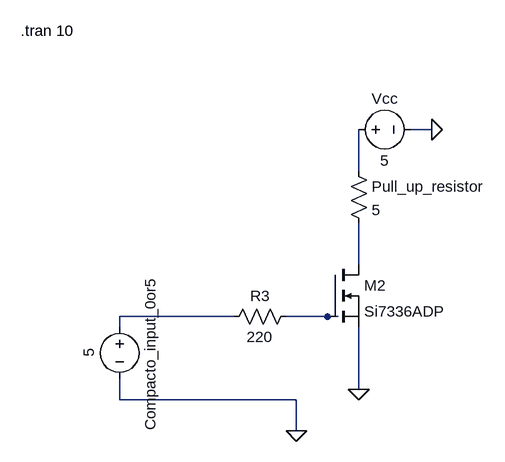
[diagram p0: schematic MOSFET circuit Ayham.asc]
MOSFET circuit Ayham.asc, the LTspice schematic file:
Version 4
SHEET 1 1264 680
WIRE -1472 -16 -1504 -16
WIRE -1584 48 -1584 -16
WIRE -1584 192 -1584 128
WIRE -1776 272 -1952 272
WIRE -1632 272 -1696 272
WIRE -1616 272 -1632 272
WIRE -1952 288 -1952 272
WIRE -1584 384 -1584 288
WIRE -1952 400 -1952 368
WIRE -1680 400 -1952 400
WIRE -1680 448 -1680 400
FLAG -1680 448 0
FLAG -1472 -16 0
FLAG -1584 384 0
SYMBOL voltage -1952 272 R0
WINDOW 0 32 56 VTop 2
WINDOW 3 -32 56 VBottom 2
WINDOW 123 0 0 Left 0
WINDOW 39 0 0 Left 0
SYMATTR InstName Compacto_input_0or5
SYMATTR Value 5
SYMBOL nmos -1632 192 R0
SYMATTR InstName M2
SYMATTR Value Si7336ADP
SYMBOL res -1680 256 R90
WINDOW 0 0 56 VBottom 2
WINDOW 3 32 56 VTop 2
SYMATTR InstName R3
SYMATTR Value 220
SYMBOL voltage -1600 -16 R270
WINDOW 0 32 56 VTop 2
WINDOW 3 -32 56 VBottom 2
WINDOW 123 0 0 Left 0
WINDOW 39 0 0 Left 0
SYMATTR InstName Vcc
SYMATTR Value 5
SYMBOL res -1600 32 R0
SYMATTR InstName Pull_up_resistor
SYMATTR Value 5
TEXT -2104 -168 Left 2 !.tran 10

The netlist it stands for:
* MOSFET circuit Ayham.asc
V§Compacto_input_0or5 N003 0 5
M2 N002 N004 0 0 Si7336ADP
R3 N004 N003 220
Vcc N001 0 5
R§Pull_up_resistor N001 N002 5
.model NMOS NMOS
.model PMOS PMOS
.lib standard.mos
.tran 10
.backanno
.end